# Altium schematic sheet HB.SchDoc
size Letter; SheetNumber: 6; SheetTotal: 8
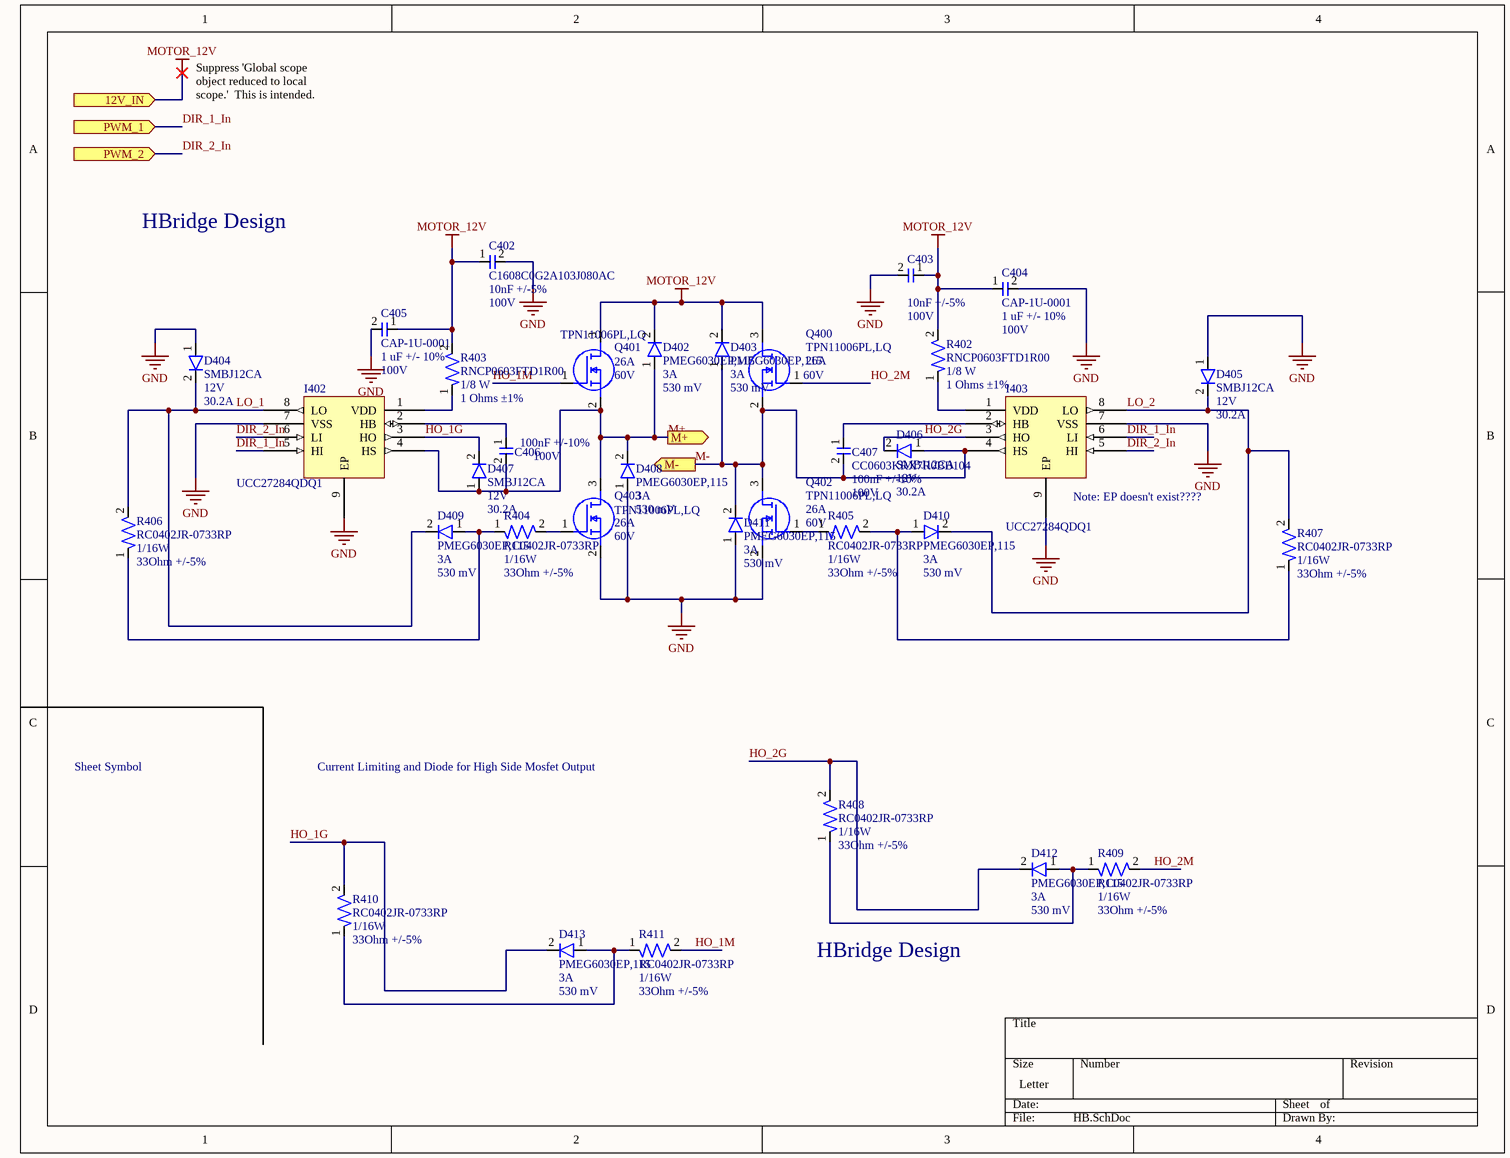
[diagram p0: HB.SchDoc]

## Parts
C402  C1608C0G2A103J080AC  Capacitance: 10nF +/-5%  Voltage Rating: 100V  [CAP-0603]
C403  Capacitance: 10nF +/-5%  Voltage Rating: 100V  [CAP-0603]  (hidden comment: C1608C0G2A103J080AC)
C404  CAP-1U-0001  Capacitance: 1 uF +/- 10%  Voltage: 100V  [CAP-1206 - duplicate]
C405  CAP-1U-0001  Capacitance: 1 uF +/- 10%  Voltage: 100V  [CAP-1206]
C406  Capacitance: 100nF +/-10%  Voltage Rating: 100V  [CAP-0603]  (hidden comment: CC0603KRX7R0BB104)
C407  CC0603KRX7R0BB104  Capacitance: 100nF +/-10%  Voltage Rating: 100V  [CAP-0603]
D402  PMEG6030EP,115  Current Rating: 3A  Vf (Voltage Forward): 530 mV  [DIO-SOD128]
D403  PMEG6030EP,115  Current Rating: 3A  Vf (Voltage Forward): 530 mV  [DIO-SOD128]
D404  SMBJ12CA  Standoff Voltage: 12V  Current Rating: 30.2A  [DO-214AA (SMBJ)]
D405  SMBJ12CA  Standoff Voltage: 12V  Current Rating: 30.2A  [DO-214AA (SMBJ)]
D406  SMBJ12CA  Standoff Voltage: 12V  Current Rating: 30.2A  [DO-214AA (SMBJ)]
D407  SMBJ12CA  Standoff Voltage: 12V  Current Rating: 30.2A  [DO-214AA (SMBJ)]
D408  PMEG6030EP,115  Current Rating: 3A  Vf (Voltage Forward): 530 mV  [DIO-SOD128]
D409  PMEG6030EP,115  Current Rating: 3A  Vf (Voltage Forward): 530 mV  [DIO-SOD128]
D410  PMEG6030EP,115  Current Rating: 3A  Vf (Voltage Forward): 530 mV  [DIO-SOD128]
D411  PMEG6030EP,115  Current Rating: 3A  Vf (Voltage Forward): 530 mV  [DIO-SOD128]
D412  PMEG6030EP,115  Current Rating: 3A  Vf (Voltage Forward): 530 mV  [DIO-SOD128]
D413  PMEG6030EP,115  Current Rating: 3A  Vf (Voltage Forward): 530 mV  [DIO-SOD128]
I402  UCC27284QDQ1  [IC-BUCK-8SOIC]
I403  UCC27284QDQ1  [IC-BUCK-8SOIC]
Q400  TPN11006PL,LQ  Id-Continuous: 26A  VDS-Max: 60V  [NMOS-8TSON]
Q401  TPN11006PL,LQ  Id-Continuous: 26A  VDS-Max: 60V  [NMOS-8TSON]
Q402  TPN11006PL,LQ  Id-Continuous: 26A  VDS-Max: 60V  [NMOS-8TSON]
Q403  TPN11006PL,LQ  Id-Continuous: 26A  VDS-Max: 60V  [NMOS-8TSON]
R402  RNCP0603FTD1R00  Power: 1/8 W  Resistance: 1 Ohms ±1%  [RES-0603]
R403  RNCP0603FTD1R00  Power: 1/8 W  Resistance: 1 Ohms ±1%  [RES-0603]
R404  RC0402JR-0733RP  Power Rating: 1/16W  Resistance: 33Ohm +/-5%  [RES-0402]
R405  RC0402JR-0733RP  Power Rating: 1/16W  Resistance: 33Ohm +/-5%  [RES-0402]
R406  RC0402JR-0733RP  Power Rating: 1/16W  Resistance: 33Ohm +/-5%  [RES-0402]
R407  RC0402JR-0733RP  Power Rating: 1/16W  Resistance: 33Ohm +/-5%  [RES-0402]
R408  RC0402JR-0733RP  Power Rating: 1/16W  Resistance: 33Ohm +/-5%  [RES-0402]
R409  RC0402JR-0733RP  Power Rating: 1/16W  Resistance: 33Ohm +/-5%  [RES-0402]
R410  RC0402JR-0733RP  Power Rating: 1/16W  Resistance: 33Ohm +/-5%  [RES-0402]
R411  RC0402JR-0733RP  Power Rating: 1/16W  Resistance: 33Ohm +/-5%  [RES-0402]

## Ports
12V_IN (in), M+ (out), M- (out), PWM_1 (in), PWM_2 (in)

## Nets
GND: C402.2 C403.2 C404.2 C405.2 D404.1 D405.1 D408.1 D411.1 I402.7(VSS) I402.9(EP) I403.7(VSS) I403.9(EP) Q402.2(S) Q403.2(S)
MOTOR_12V: C402.1 C403.1 C404.1 C405.1 D402.2 D403.2 Q400.3(D) Q401.3(D) R402.2 R403.2 ; port 12V_IN
DIR_1_In: I402.5(HI) I403.6(LI) ; port PWM_1
DIR_2_In: I402.6(LI) I403.5(HI) ; port PWM_2
HO_1G: D407.2 D413.2 I402.3(HO) R410.2
HO_1M: Q401.1(G) R411.2
HO_2G: D406.2 D412.2 I403.3(HO) R408.2
HO_2M: Q400.1(G) R409.2
LO_1: D404.2 D409.2 I402.8(LO) R406.2
LO_2: D405.2 D410.2 I403.8(LO) R407.2
M+: C406.2 D402.1 D407.1 D408.2 I402.4(HS) Q401.2(S) Q403.3(D) ; port M+
M-: C407.2 D403.1 D406.1 D411.2 I403.4(HS) Q400.2(S) Q402.3(D) ; port M-
NetC406_1: C406.1 I402.2(HB)
NetC407_1: C407.1 I403.2(HB)
NetD409_1: D409.1 R404.1 R406.1
NetD410_1: D410.1 R405.2 R407.1
NetD412_1: D412.1 R408.1 R409.1
NetD413_1: D413.1 R410.1 R411.1
NetI402_1: I402.1(VDD) R403.1
NetI403_1: I403.1(VDD) R402.1
NetQ402_1: Q402.1(G) R405.1
NetQ403_1: Q403.1(G) R404.2

## Notes on the sheet
- Suppress 'Global scope object reduced to local scope.'  This is intended.
- HBridge Design
- (near I403) Note: EP doesn't exist????
- Sheet Symbol
- Current Limiting and Diode for High Side Mosfet Output

## Library data of the parts
C402 C403 = CAP-10N-0002: CAP CER 10000PF 100V C0G 0603; Manufacturer: TDK Corporation; Temperature Coefficient: C0G/NP0; Assembled?: no; Manufacturer Part Number: C1608C0G2A103J080AC; Package Size: 0603
C404 C405 = CAP-1U-0001: 1 µF ±10% 100V Ceramic Capacitor X7R 1206 (3216 Metric)
C406 C407 = CAP-100N-0001: CAP CER 0.1UF 100V X7R 0603; Manufacturer: YAGEO; Assembled?: no; Manufacturer Part Number: CC0603KRX7R0BB104; Temperature Coefficient: X7R; Package Size: 0603
D402 D403 D408-D413 = DIO-0.53V-0001: Diode Schottky 60 V 3A Surface Mount SOD-128/CFP5; Manufacturer: Nexperia USA Inc.; Assembled: no; Manufacturer Part Number: PMEG6030EP,115; Package: SOD-128/CFP5
D404-D407 = DIO-19.9V-0001: 19.9V Clamp 30.2A Ipp Tvs Diode Surface Mount DO-214AA (SMBJ); Manufacturer: Littlefuse Inc.; Assembled: No; Breakdown Voltage: 13.3; Manufacturer Part Number: SMBJ12CA; Package: DO-214AA (SMBJ)
I402 I403 = IC-GDRV-0001: Gate Drivers Automotive 3-A, 120-V half bridge gate driver with 5-V UVLO and enable 8-SOIC -40 to 125; Manufacturer: Texas Instruments; Assembled?: no; VCC-Max: 16V; VCC-Min: 5.5V; Load Voltage-Max: 120V; Supply Current: 3A; Manufacturer Part Number: UCC27284QDQ1; Package: SOIC-8
Q400-Q403 = NMOS-26A-0001: MOSFET N-CH 60V 200MA SOT23; Manufacturer: Toshiba; FET type: N-Channel; Rds On-Max: 18.1mOhm; Vgs-Max: 20V; Assembled?: no; Manufacturer Part Number: TPN11006PL,LQ; Package: 8-TSON Advance
R402 R403 = RES-1-0001: 1 Ohms ±1% 0.125W, 1/8W Chip Resistor 0603 (1608 Metric) Anti-Sulfur Thin Film
R404-R411 = RES-33-0001: RES SMD 33 OHM 5% 1/16W 0402; Manufacturer: YAGEO; Assembled?: no; Manufacturer Part Number: RC0402JR-0733RP; Package Size: 0402